# EAGLE design fonte (EAGLE 9.6.2)
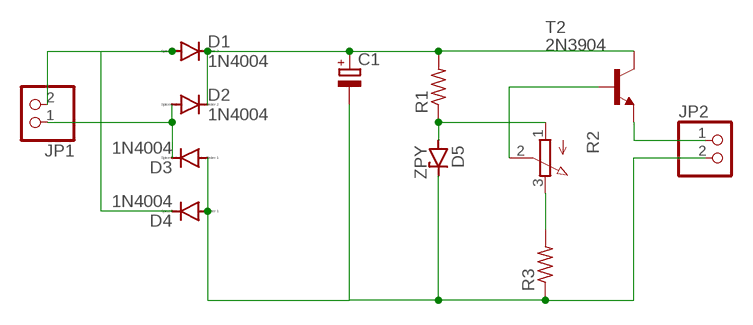
[diagram p0: schematic, sheet 1]

## Parts
C1  CPOL-EUE3.5-10  [E3,5-10]
D1  1N4004  [DO41-10]
D2  1N4004  [DO41-10]
D3  1N4004  [DO41-10]
D4  1N4004  [DO41-10]
D5  ZPY  [DO41Z10]
JP1  PINHD-1X2  [1X02]
JP2  PINHD-1X2  [1X02]
R1  R-US_0207/10  [0207/10]
R2  3RP/1610N  [3RP/1610N]
R3  R-US_0207/10  [0207/10]
T2  2N3904  [TO92]

## Nets
N$1: D1.A D4.C JP1.2
N$2: D2.A D3.C JP1.1
N$3: JP2.1 T2.3(E)
N$4: C1.+ D1.C D2.C R1.2 T2.1(C)
N$5: D5.A R1.1 R2.1(A)
N$6: R2.2(S) T2.2(B)
N$9: R2.3(E) R3.2
N$11: C1.- D3.A D4.A D5.C JP2.2 R3.1

## Library data of the parts
C1 = rcl:CPOL-EU: POLARIZED CAPACITOR, European symbol; SPICEPREFIX: C
D1-D4 = diode:1N4004: DIODE general purpose rectifier, 1 A
D5 = diode:ZPY: Z DIODE 1 W
JP1 JP2 = pinhead:PINHD-1X2: PIN HEADER
R1 R3 = rcl:R-US_: RESISTOR, American symbol; SPICEPREFIX: R
R2 = pot:3RP/1610N: 16mm Potentiometer one level Source: http://www.alphapotentiometers.net/html/16mm_pot_2.html
T2 = transistor:2N3904: NPN TRANSISTOR

## Board
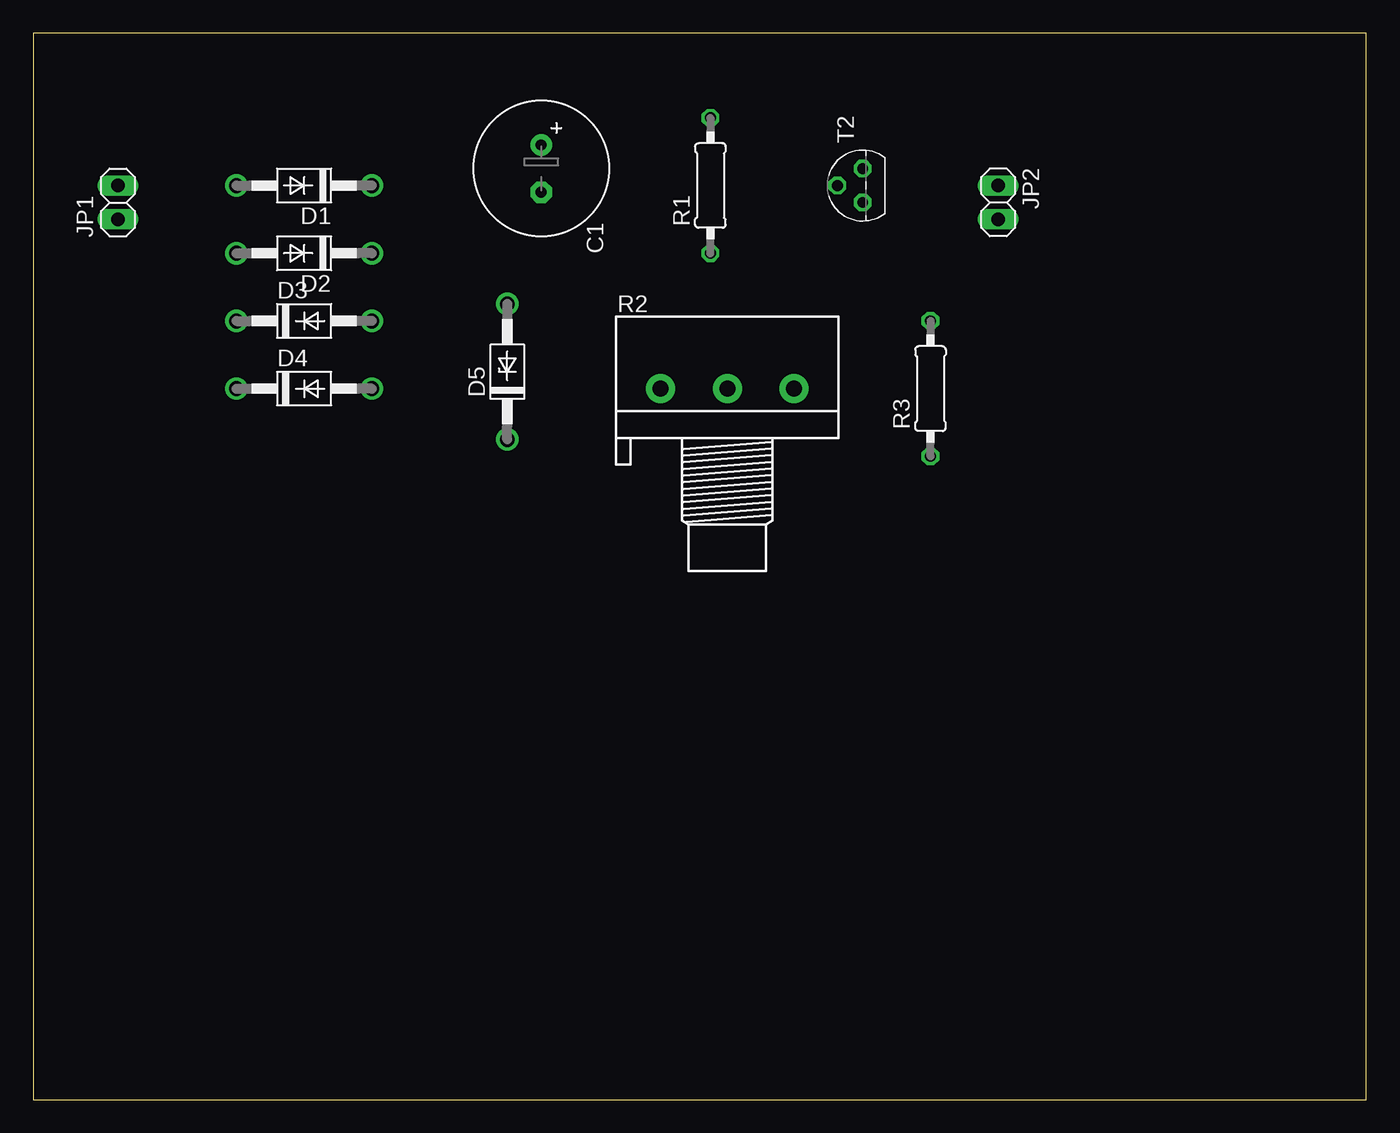
[diagram p1: board, top side]
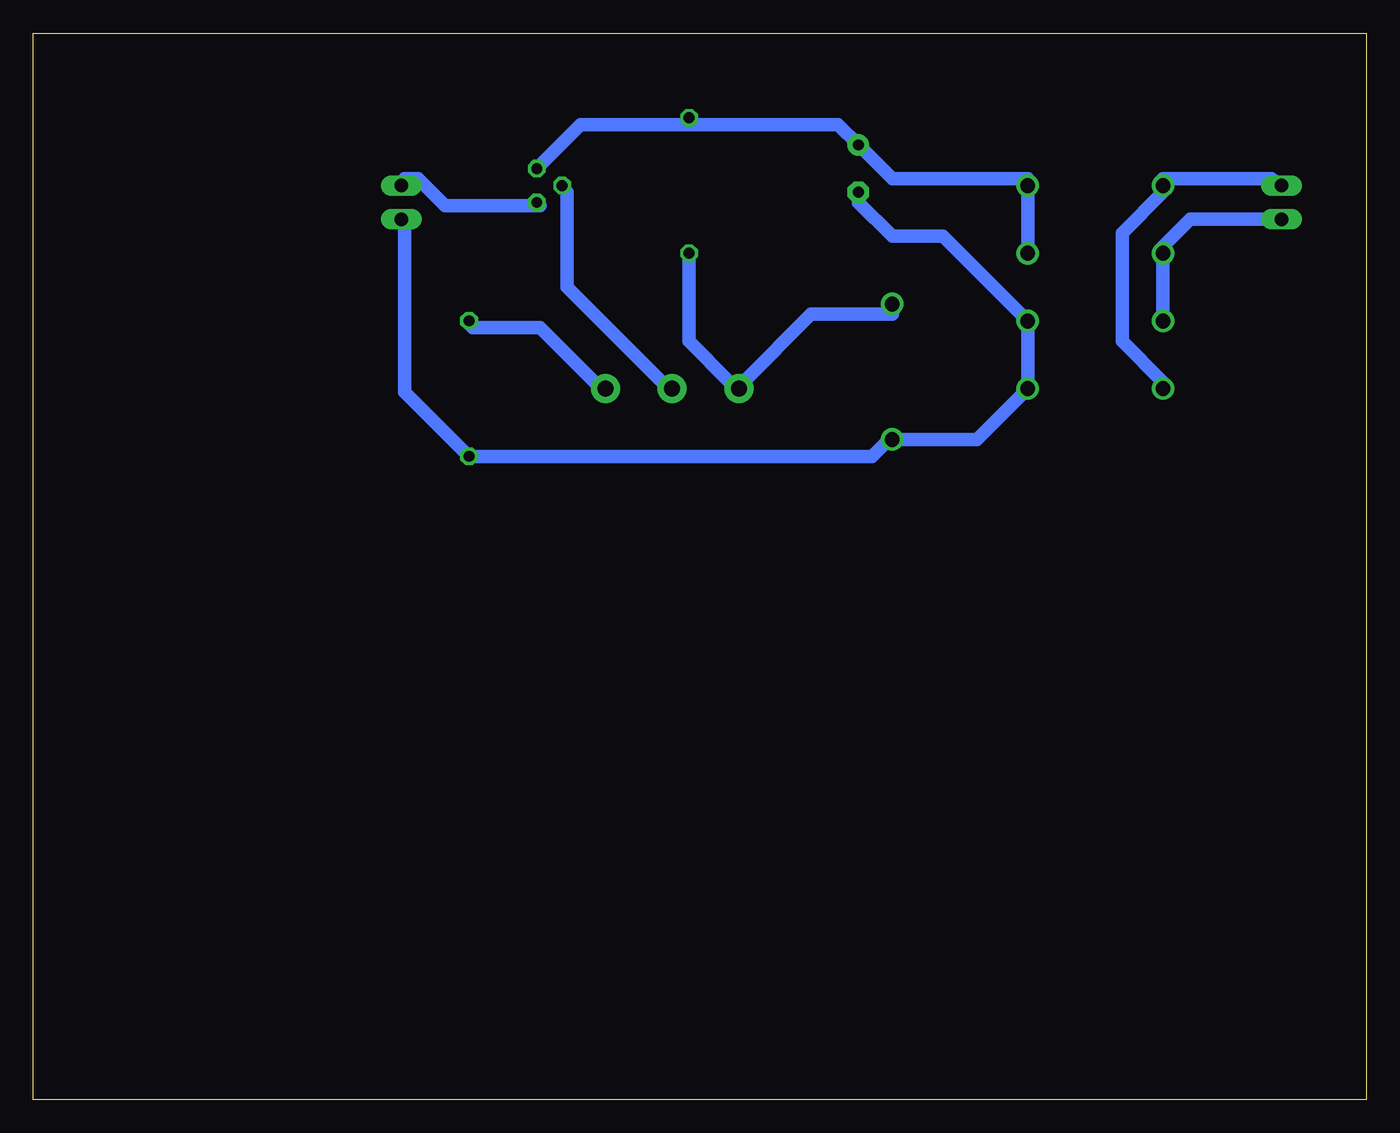
[diagram p2: board, bottom side, seen from below]

Size 100 x 80 mm. Coordinates in mm from the lower left corner, seen from the top.
Outline: 0,0 100,0 100,80 0,80 0,0
Copper layers (1*16): Top 0.035mm / dielectric 1.5mm / Bottom 0.035mm
Design rules "default *": minimum track width 40mil, minimum drill 0.35mm, track to track 40mil, track to pad 40mil, pad to pad 40mil, via to via 0mil, smd to smd 6mil, copper to edge 40mil, drill to drill 6mil, minimum pad ring 10mil, minimum via ring 8mil, stop-mask expansion 4mil, vias tented up to drill 0mil, thermal gap 10mil

### Footprints (pad centres in the part's own frame; a part is rotated, then mirrored left to right if it is on the bottom)
E3,5-10 = drill 0.813 pad 1.6: + -1.778,0 | drill 0.813 pad 1.6 octagon: - 1.778,0
DO41-10 = drill 1.118: A 5.08,0; C -5.08,0
DO41Z10 = drill 1.118: A 5.08,0; C -5.08,0
1X02 = drill 1.016 long: 1 -1.27,0; 2 1.27,0
0207/10 = drill 0.813 octagon: 1 -5.08,0; 2 5.08,0
3RP/1610N = drill 1.2 pad 2.184: 1 -5,0; 2 0,0; 3 5,0
TO92 = drill 0.813 octagon: 1 1.27,0; 2 0,1.905; 3 -1.27,0

### Placement (x,y rotation side)
C1  38.1,69.85 270 top
D1  20.32,68.58 180 top
D2  20.32,63.5 180 top
D3  20.32,58.42 0 top
D4  20.32,53.34 0 top
D5  35.56,54.61 90 top
JP1  6.35,67.31 90 top
JP2  72.39,67.31 270 top
R1  50.8,68.58 90 top
R2  52.07,53.34 0 top
R3  67.31,53.34 90 top
T2  62.23,68.58 90 top

### Tracks (layer width: path | path; a pad name or v marks a point on that pad's centre or on a via)
N$1
  Bottom 1.016: JP1.2 7.11,69.09 15.24,69.09 D1.A 15.24,68.07 18.29,65.02 18.29,56.9 15.24,53.85 D4.C
N$2
  Bottom 1.016: JP1.1 13.21,66.04 15.24,64.01 D2.A D3.C
N$3
  Bottom 1.016: T2.3 61.98,67.06 69.09,67.06 71.12,69.09 72.14,69.09 JP2.1
N$4
  Bottom 1.016: D2.C D1.C 25.4,69.09 35.56,69.09 C1.+ 39.62,73.15 50.8,73.15 | T2.1 58.93,73.15 50.8,73.15 | 50.8,73.15 R1.2
N$5
  Bottom 1.016: R1.1 50.8,56.9 47.75,53.85 R2.1 46.74,53.85 41.66,58.93 35.56,58.93 D5.A
N$6
  Bottom 1.016: T2.2 59.94,68.07 59.94,60.96 52.83,53.85 R2.2
N$9
  Bottom 1.016: R3.2 67.06,57.91 61.98,57.91 57.91,53.85 R2.3
N$11
  Bottom 1.016: JP2.2 72.14,66.04 72.14,53.09 R3.1 37.08,48.26 35.56,49.78 D5.C 29.21,49.53 D4.A D3.A 31.75,64.77 35.56,64.77 38.1,67.31 C1.-